# Altium schematic sheet TAG.SchDoc
size A4; SheetNumber: 7; SheetTotal: 7
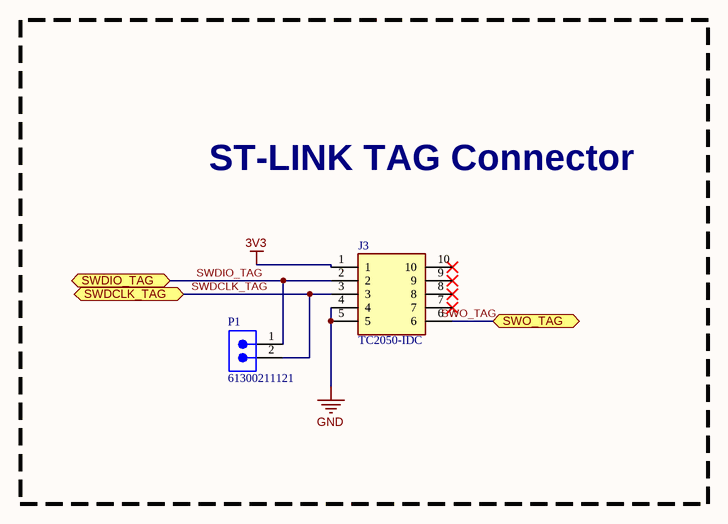
[diagram p0: TAG.SchDoc]

## Parts
J3  TC2050-IDC  [TC2050-IDC]
P1  61300211121  [61300211121]

## Blocks framed on the sheet
ST-LINK TAG Connector: J3 P1

## Ports
SWDCLK_TAG (bidir), SWDIO_TAG (bidir), SWO_TAG (bidir)

## Nets
3V3: J3.1
GND: J3.4 J3.5
SWDCLK_TAG: J3.3 P1.2 ; port SWDCLK_TAG
SWDIO_TAG: J3.2 P1.1 ; port SWDIO_TAG
SWO_TAG: J3.6 ; port SWO_TAG

Not connected (* = marked no-connect by the designer): J3 7* 8* 9* 10*

## Library data of the parts
J3 = TC2050-IDC: Connector; Manufacturer_Name: Tag Connect; Datasheet Link: https://datasheet.datasheetarchive.com/originals/distributors/Datasheets_SAMA/51f607a36a24a0aceedaa5d6ebc30014.pdf; Manufacturer_Part_Number: TC2050-IDC
P1 = CMP-096-000133-1: WR-PHD Pin Header, THT, Vertical, pitch 2.54mm, 1 Row, 2P; Manufacturer: Wurth Elektronik; Working Voltage: 250V; Contact Resistance: 20mOhm; Rated Current: 3A; Withstanding Voltage: 500V; Orientation: Vertical; Number of Rows: 1; Match Code: WR-PHD; Pin Count: 2; Gender: Pin Header; Source: WR-PHD.SchLib; Packaging: Bag; Manufacturer Part Number: 61300211121; Operating Temperature Min: -40°C; Component Type: Standard; ComponentLink1URL: https://www.we-online.com/redexpert/article/61300211121?ad; Pitch: 2.54mm; Mount: Through Hole; ComponentLink1Description: Website Link; ComponentLink2Description: Datasheet Link; Number of Pins: 2; Category: Board-to-Board Connectors; Design Item ID: 61300211121; ComponentLink2URL: https://www.we-online.com/redexpert/spec/61300211121?ad; Operating Temperature Max: 105°C